# EasyEDA Pro project pcb.epro

# Board PCB1
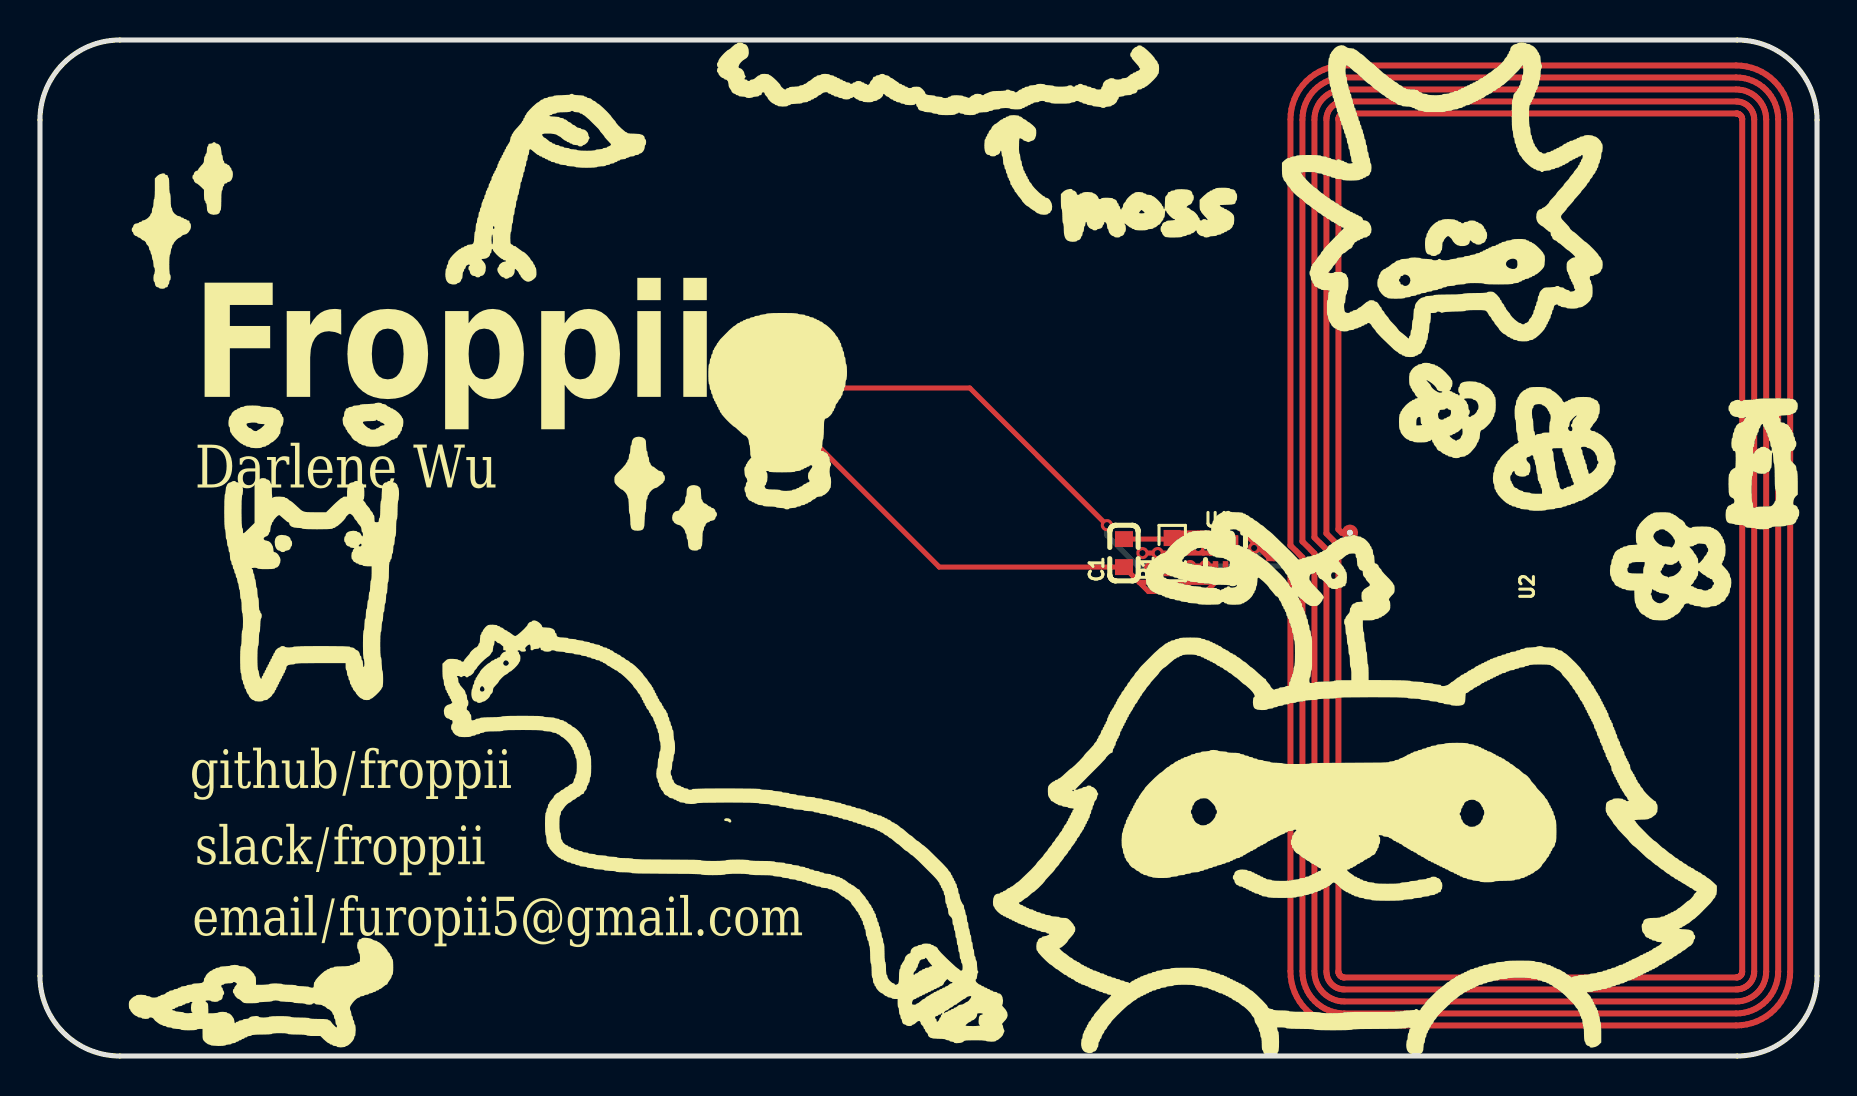
[diagram p0: board, top side]
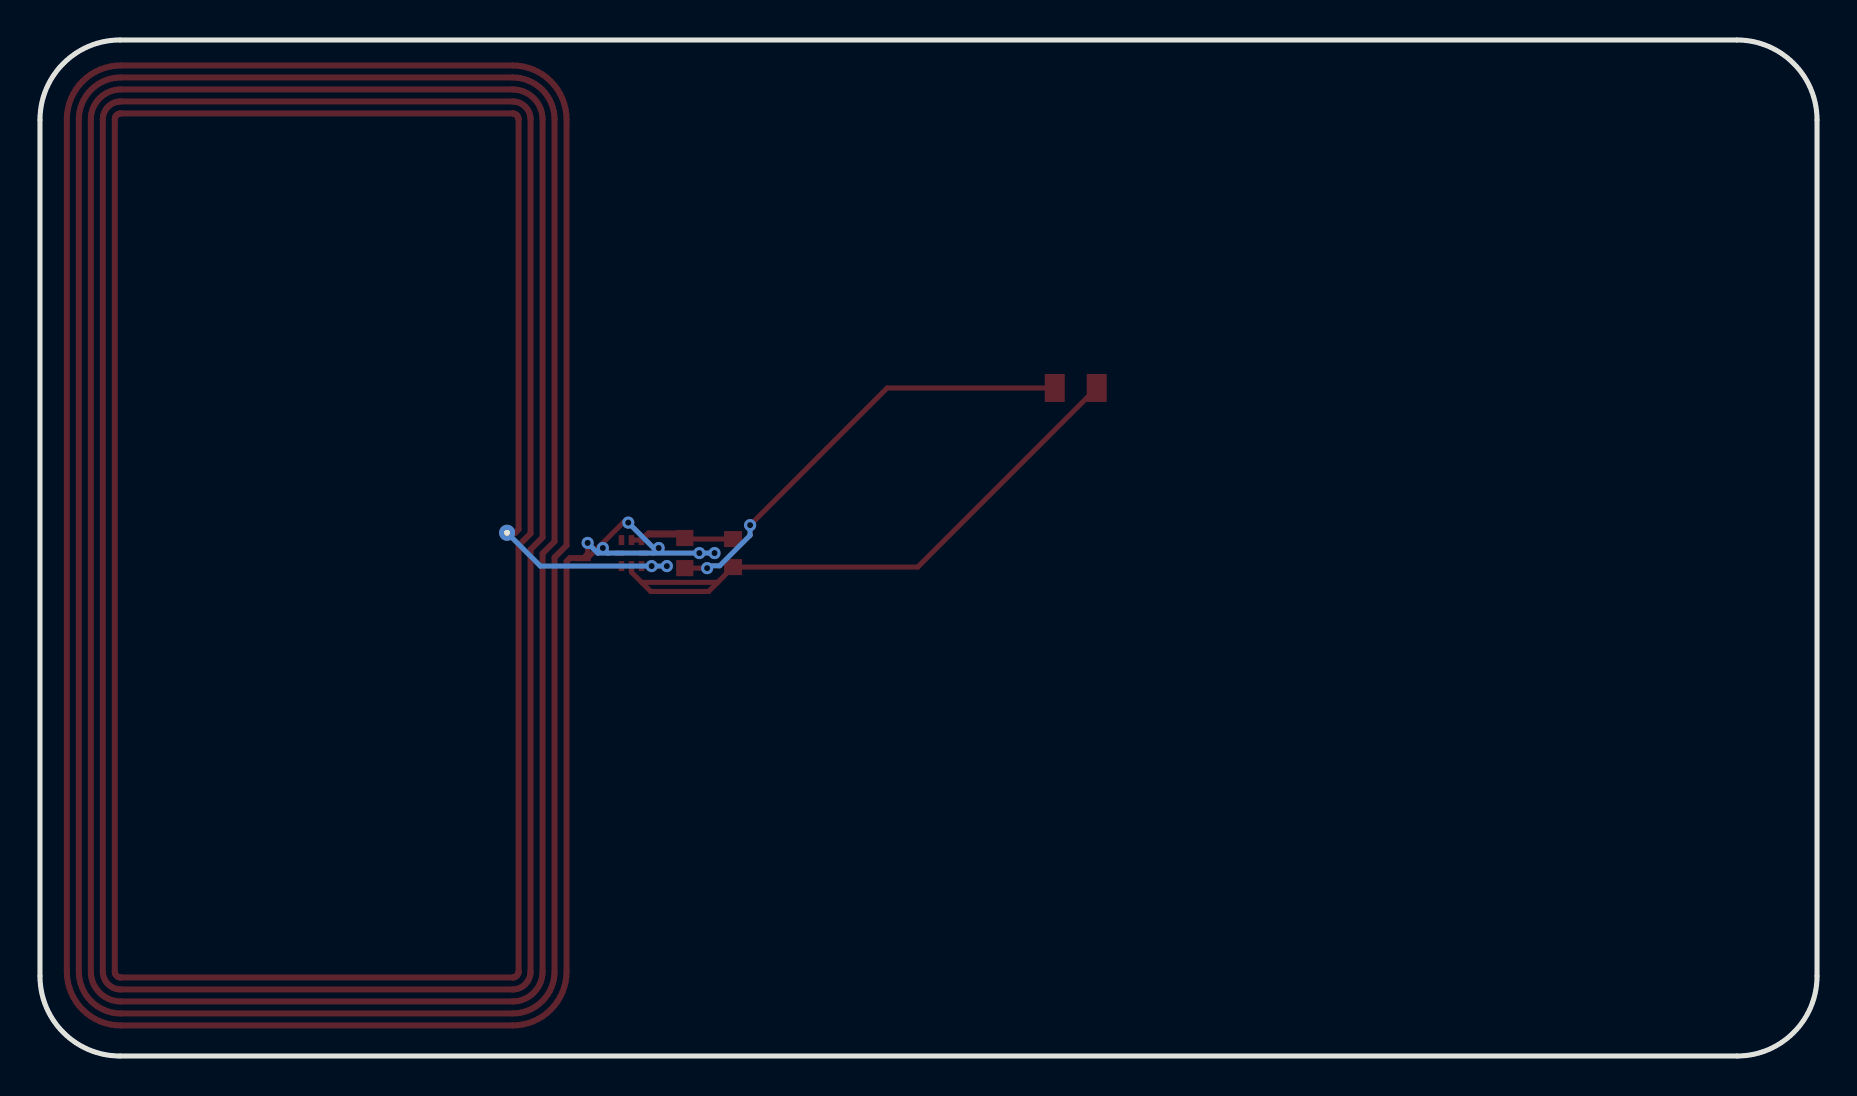
[diagram p1: board, bottom side, seen from below]

Outline 88.9 x 50.8 mm; copper layers: Top Layer, Bottom Layer. Coordinates in mm from the lower left corner of the outline.
Outline path: 0,46.8 0,4 arc(1.17,1.17) 4,0 84.9,0 arc(87.73,1.17) 88.9,4 88.9,46.8 arc(87.73,49.63) 84.9,50.8 4,50.8 arc(1.17,49.63) 0,46.8
Stack: Top Layer 0.035mm / Dielectric1 1.51mm FR4 er 4.5 / Bottom Layer 0.035mm

## Design rules (mm)
template: JLCPCB Capability(Two Layers Board)
spacing copperThickness1oz (default): track to track 0.102, other pairs 0.152 to 0.3
spacing copperThickness2oz: track to track 0.203, other pairs 0.152 to 0.3
track width copperThickness1oz (default): min 0.127, default 0.254, max 2.54
track width copperThickness2oz: min 0.203, default 0.254, max 2.54
differential pair differentialPair (default): width min 0.127, default 0.254, max 2.54; gap min 0.152, default 0.152
via viaSize (default): diameter min 0.5, default 0.61, max 10; hole min 0.3, default 0.305, max 6.3

## Placement (name value [footprint] x y rotation side)
C1  220nF  [C0603]  54.23 25.15 90 top
LED1  KT-0805Y  [LED0805-R-RD]  37.08 33.4 0 top
R1  47Ω  [R0603]  56.64 25.15 90 top
U1  13.56MHz  [XQFN-8_L1.6-W1.6-P0.50-BL_NT3H2111W0FHKH]  59.31 25.15 0 top
U2  -  [25X48MM_NFC_ANTENNA]  75.06 25.53 90 top

## Footprints (pads in the part's own frame, mm; a bottom-side part is the same pattern mirrored in y, then rotated)
25X48MM_NFC_ANTENNA
  rect 0.3x0.75 smd: P$1(-0.635,13.335)
  round 0.808 hole 0.3: P$2(0.635,9.525)
C0603
  rect 0.8x0.9 smd: 1(-0.7,0) 2(0.7,0)
LED0805-R-RD
  rect 1x1.399 smd: 1(1.05,0) 2(-1.05,0)
R0603
  rect 0.806x0.864 smd: 1(-0.753,0) 2(0.753,0)
XQFN-8_L1.6-W1.6-P0.50-BL_NT3H2111W0FHKH
  rect 0.28x0.5 smd: 1(-0.5,-0.65) 2(0,-0.65) 3(0.5,-0.65) 5(0.5,0.65) 6(0,0.65) 7(-0.5,0.65)
  rect 0.45x0.3 smd: 4(0.6,0) 8(-0.6,0)

## Nets
$1N570: C1.2 R1.2 U1.6 U1.7
$1N576: C1.1 LED1.2 U1.2
$1N583: U1.1 U2.P$2
$1N589: U1.8 U2.P$1
$1N619: LED1.1 R1.1

Pads without a net: U1 3 4 5

## Via types
v1: diameter 0.61, hole 0.305, Top Layer to Bottom Layer, 10 vias

## Routing (per net, layer and track width the routed paths; a pad name or vN(x,y) marks a point on that pad's centre or on a via; arc(x,y) is an arc through that point)
$1N570: length 7.1
  Top Layer w0.254: 56.79,26.05 R1.2 56.59,25.85 C1.2 ; 56.79,26.05 56.9,26.15 58.45,26.15 58.55,26.05 ; 56.79,26.05 58.55,26.05 ; 58.55,26.05 U1.7 U1.6
$1N576: length 32
  Top Layer w0.254: LED1.2 44.99,24.45 C1.1 54.99,23.68 ; 54.99,23.68 58.8,23.68 ; 54.99,23.68 55.45,23.23 58.34,23.23 58.8,23.68 ; 59.31,24.5 59.31,24.19 58.8,23.68
$1N583: length 10
  Top Layer w0.254: 58.81,24.5 v1(58.3,24.5) v1(57.54,24.5)
  Bottom Layer w0.254: U2.P$2 63.87,24.5 v1(58.3,24.5) v1(57.54,24.5)
$1N589: length 17
  Top Layer w0.254: v1(61.5,25.65) 61.5,25.15 61.72,24.89 61.5,24.89 60.99,25.4 ; U1.8 58.2,25.15 ; 58.2,25.15 v1(57.95,25.4) ; 58.2,25.15 v1(55.92,25.15) v1(55.15,25.15) ; 60.99,25.4 59.73,26.67 v1(59.47,26.67) ; 60.99,25.4 v1(60.74,25.4)
  Bottom Layer w0.254: 60.49,25.15 60.99,25.15 v1(61.5,25.65) ; 60.49,25.15 v1(55.92,25.15) v1(55.15,25.15) ; 60.49,25.15 v1(60.74,25.4) ; v1(57.95,25.4) 58.2,25.4 v1(59.47,26.67)
$1N619: length 22.5
  Top Layer w0.254: LED1.1 46.52,33.4 v1(53.37,26.54) ; v1(55.52,24.39) R1.1
  Bottom Layer w0.254: v1(55.52,24.39) 55.41,24.51 54.9,24.51 53.37,26.03 v1(53.37,26.54)

## Text on the board
Top Silkscreen Layer: github/froppii | email/furopii5@gmail.com | slack/froppii | Froppii | Darlene Wu
